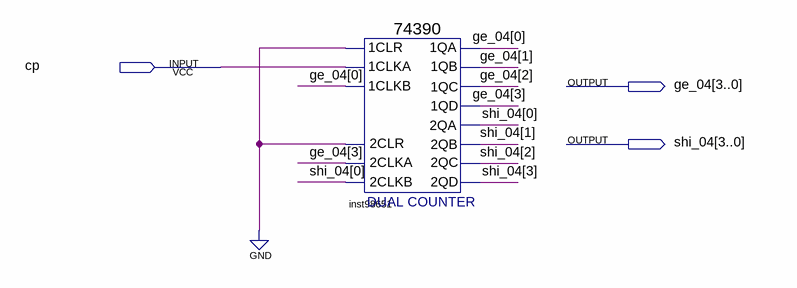
[diagram p0: schematic sheet]
// Quartus schematic counter100.bdf as structural Verilog: 1 symbols, 3 pins
module counter100 (
  input  cp,
  output [3:0] ge_04,
  output [3:0] shi_04
);

  \74390  inst98651 (
    .\2CLKA (ge_04[3]), .\2CLR (1'b0), .\2CLKB (shi_04[0]), .\1CLR (1'b0), .\1CLKA (cp), .\1CLKB (ge_04[0]),
    .\1QA (ge_04[0]), .\1QB (ge_04[1]), .\1QC (ge_04[2]), .\1QD (ge_04[3]), .\2QA (shi_04[0]),
    .\2QB (shi_04[1]), .\2QC (shi_04[2]), .\2QD (shi_04[3]));
endmodule
